# Altium schematic sheet controlmodule.SchDoc
size A4
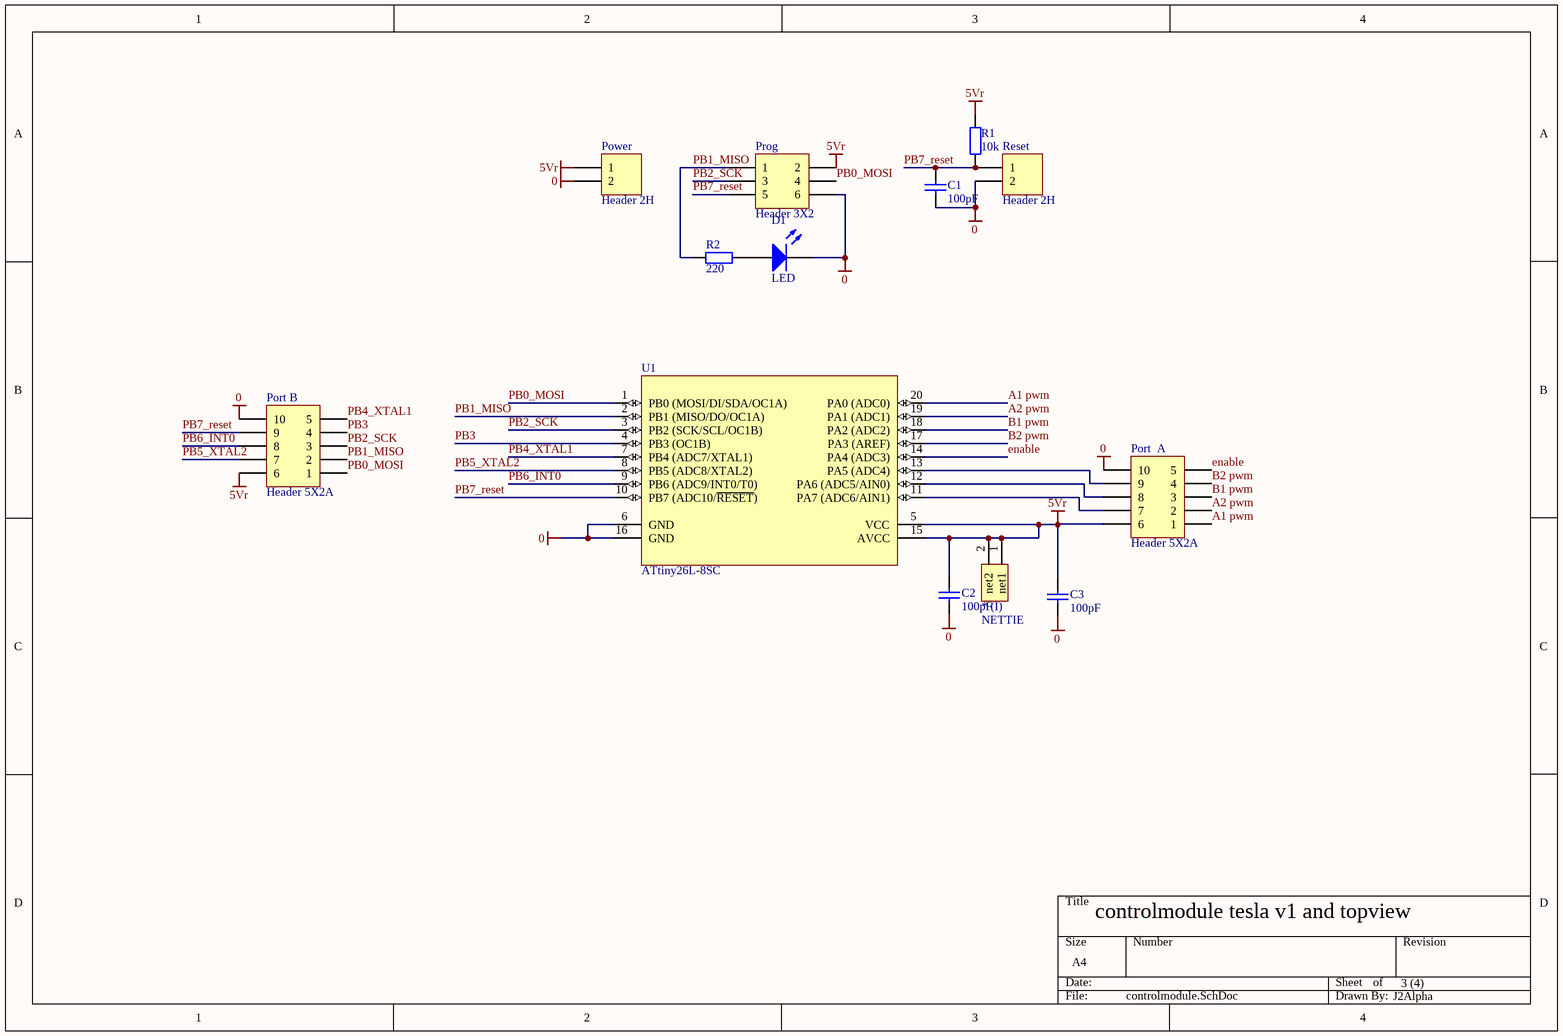
[diagram p0: controlmodule.SchDoc]

## Parts
*_(I)  NETTIE  [NETTIE]
C1  100pF  [1608[0603]]
C2  100pF  [1608[0603]]
C3  100pF  [1608[0603]]
D1  LED  [1608[0603] - LED]
Port_A  Header 5X2A  [HDR2X5_CEN]
Port_B  Header 5X2A  [HDR2X5_CEN]
Power  Header 2H  [HDR1X2H]
Prog  Header 3X2  [HDR2X3]
R1  10k  [1005[0402]]
R2  220  [1005[0402]]
Reset  Header 2H  [HDR1X2H]
U1  ATtiny26L-8SC  [20S_N]

## Nets
0: C1.1 C2.1 C3.1 D1.2(K) Port_A.10 Port_B.10 Power.2 Prog.6 Reset.2 U1.6(GND) U1.16(GND)
5Vr: *_(I).1(net1) *_(I).2(net2) C2.2 C3.2 Port_A.6 Port_B.6 Power.1 Prog.2 R1.2 U1.5(VCC) U1.15(AVCC)
A1 pwm: Port_A.1 U1.20(PA0_(ADC0))
A2 pwm: Port_A.2 U1.19(PA1_(ADC1))
B1 pwm: Port_A.3 U1.18(PA2_(ADC2))
B2 pwm: Port_A.4 U1.17(PA3_(AREF))
enable: Port_A.5 U1.14(PA4_(ADC3))
PB0_MOSI: Port_B.1 Prog.4 U1.1(PB0_(MOSI/DI/SDA/OC1A))
PB1_MISO: Port_B.2 Prog.1 R2.1 U1.2(PB1_(MISO/DO/OC1A))
PB2_SCK: Port_B.3 Prog.3 U1.3(PB2_(SCK/SCL/OC1B))
PB3: Port_B.4 U1.4(PB3_(OC1B))
PB4_XTAL1: Port_B.5 U1.7(PB4_(ADC7/XTAL1))
PB5_XTAL2: Port_B.7 U1.8(PB5_(ADC8/XTAL2))
PB6_INT0: Port_B.8 U1.9(PB6_(ADC9/INT0/T0))
PB7_reset: C1.2 Port_B.9 Prog.5 R1.1 Reset.1 U1.10(PB7_(ADC10/~{RESET}))
NetD1_1: D1.1(A) R2.2
NetPort_A_7: Port_A.7 U1.11(PA7_(ADC6/AIN1))
NetPort_A_8: Port_A.8 U1.12(PA6_(ADC5/AIN0))
NetPort_A_9: Port_A.9 U1.13(PA5_(ADC4))

## Notes on the sheet
- controlmodule tesla v1 and topview
- 3 (4)
- J2Alpha

## Library data of the parts
*_(I) = NETTIE: connects 2 nets, connect both terminals or shit goes down
C1-C3 = Cap_mm: Capacitor; Published: 8-Jun-2000; LatestRevisionDate: 17-Jul-2002; LatestRevisionNote: Re-released for DXP Platform.; PackageReference: RAD-0.3; Publisher: Altium Limited; Farnell code: *; Value: 100pF
Port_A Port_B = Header 5X2A: Header, 5-Pin, Dual row; LatestRevisionDate: 17-Jul-2002; LatestRevisionNote: Re-released for DXP Platform.; Publisher: Altium Limited
Power Reset = Header 2H: Header, 2-Pin, Right Angle; LatestRevisionDate: 17-Jul-2002; LatestRevisionNote: Re-released for DXP Platform.; Publisher: Altium Limited
Prog = Header 3X2: Header, 3-Pin, Dual row; LatestRevisionDate: 17-Jul-2002; LatestRevisionNote: Re-released for DXP Platform.; Publisher: Altium Limited
R1 R2 = Res_mm: Resistor; Published: 8-Jun-2000; LatestRevisionDate: 17-Jul-2002; LatestRevisionNote: Re-released for DXP Platform.; PackageReference: AXIAL-0.4; Publisher: Altium Limited; Farnell code: *
  R1: Value: 10k
  R2: Value: 220
U1 = ATtiny26L-8SC: 8-Bit AVR Microcontroller with 2K Bytes of Flash Memory; Published: 17-Sep-2003; LatestRevisionDate: 13-Apr-2006; LatestRevisionNote: IPC-7351 Footprint Added.; DatasheetVersion: 1477C-AVR-09/02; PackageVersion: Aug-1999; PackageReference: 20S; Publisher: Altium Limited; PackageDescription: 20-Pin Small Outline Integrated Circuit 1.27 mm Pitch; ComponentLink1Description: Manufacturer Link; ComponentLink1URL: http://www.atmel.com; ComponentLink2Description: Datasheet; ComponentLink2URL: http://www.atmel.com/dyn/resources/prod_documents/doc1477.pdf
D1 = LED: Published: 8-Jun-2000; LatestRevisionDate: 17-Jul-2002; LatestRevisionNote: Re-released for DXP Platform.; PackageDocument: Feb-2002; PackageReference: 3.2X1.6X1.1; Publisher: Altium Limited; Farnell code: *